# EasyEDA Pro project ProProject_bag cutting clutch break controller_2024-04-06.epro

# Schematic Schematic1
Create Date: 2024-03-30; Page Name: P1; Project Name: bag cutting clutch break controller; Schematic Name: Schematic1; Update Date: 2024-04-04; Company: EasyEDA.com; Drawn: EasyEDA; Page Size: A4; Part Number: JLCPCB-002; Reviewed: EasyEDA; Version: V0.1
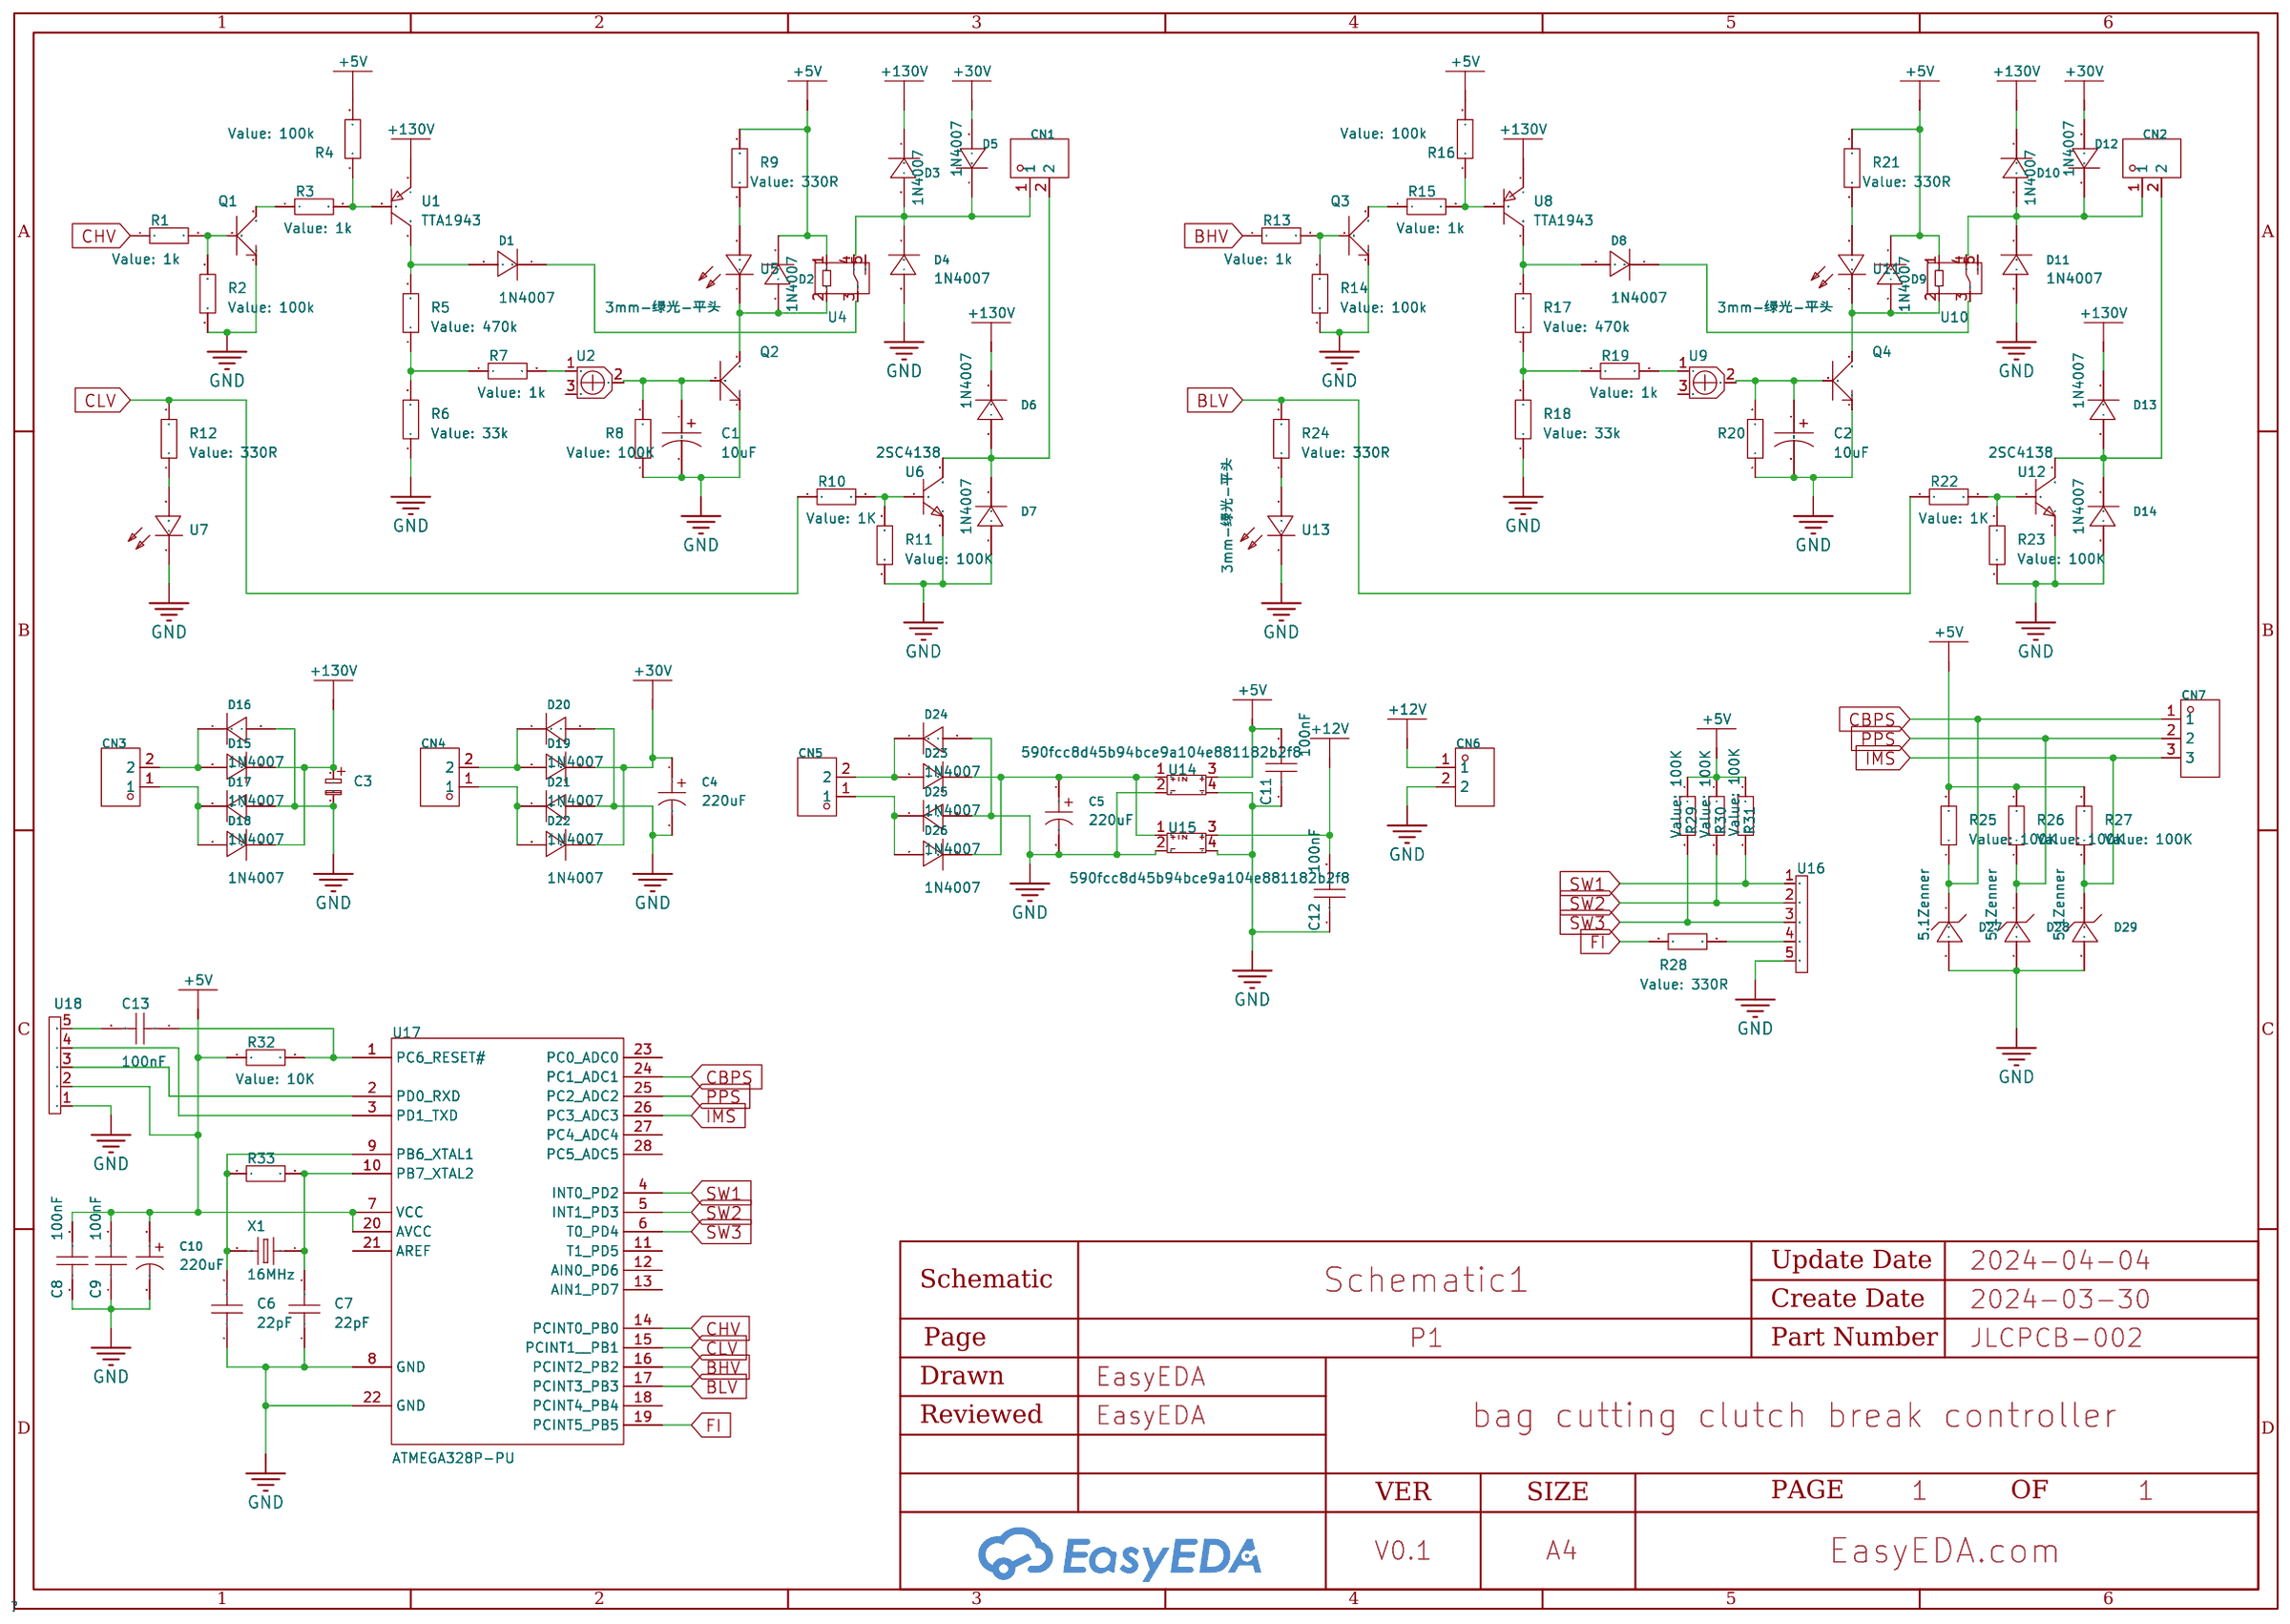
[diagram p0: schematic sheet]

## Parts
C1  10uF  [CAP-TH_BD5.0-P2.00-D0.8-FD]
C2  10uF  [CAP-TH_BD5.0-P2.00-D0.8-FD]
C3  -  [820uf400v]
C4  220uF  [CAP-TH_BD8.0-P3.50-D0.6-FD_1]
C5  220uF  [CAP-TH_BD8.0-P3.50-D0.6-FD_1]
C6  22pF  [CAP-TH_L4.0-W2.6-P2.50-D0.5]
C7  22pF  [CAP-TH_L4.0-W2.6-P2.50-D0.5]
C8  100nF  [CAP-TH_L4.0-W2.6-P2.50-D0.5]
C9  100nF  [CAP-TH_L4.0-W2.6-P2.50-D0.5]
C10  220uF  [CAP-TH_BD8.0-P3.50-D0.6-FD_1]
C11  100nF  [CAP-TH_L4.0-W2.6-P2.50-D0.5]
C12  100nF  [CAP-TH_L4.0-W2.6-P2.50-D0.5]
C13  100nF  [CAP-TH_L4.0-W2.6-P2.50-D0.5]
CN1  MX301-5.0-02P-BU01-Cu-Y-A  [CONN-TH_2P-P5.0-MX301-5.0-02P-BU01-CU-Y-A]
CN2  MX301-5.0-02P-BU01-Cu-Y-A  [CONN-TH_2P-P5.0-MX301-5.0-02P-BU01-CU-Y-A]
CN3  MX301-5.0-02P-BU01-Cu-Y-A  [CONN-TH_2P-P5.0-MX301-5.0-02P-BU01-CU-Y-A]
CN4  MX301-5.0-02P-BU01-Cu-Y-A  [CONN-TH_2P-P5.0-MX301-5.0-02P-BU01-CU-Y-A]
CN5  MX301-5.0-02P-BU01-Cu-Y-A  [CONN-TH_2P-P5.0-MX301-5.0-02P-BU01-CU-Y-A]
CN6  MX301-5.0-02P-BU01-Cu-Y-A  [CONN-TH_2P-P5.0-MX301-5.0-02P-BU01-CU-Y-A]
CN7  MX301-5.0-03P-BU01-Cu-Y-A  [CONN-TH_3P-P5.0-MX301-5.0-03P-BU01-CU-Y-A]
D1  1N4007  [DO-41_BD2.4-L4.7-P8.70-D0.9-RD]
D2  1N4007  [DO-41_BD2.4-L4.7-P8.70-D0.9-RD]
D3  1N4007  [DO-41_BD2.4-L4.7-P8.70-D0.9-RD]
D4  1N4007  [DO-41_BD2.4-L4.7-P8.70-D0.9-RD]
D5  1N4007  [DO-41_BD2.4-L4.7-P8.70-D0.9-RD]
D6  1N4007  [DO-41_BD2.4-L4.7-P8.70-D0.9-RD]
D7  1N4007  [DO-41_BD2.4-L4.7-P8.70-D0.9-RD]
D8  1N4007  [DO-41_BD2.4-L4.7-P8.70-D0.9-RD]
D9  1N4007  [DO-41_BD2.4-L4.7-P8.70-D0.9-RD]
D10  1N4007  [DO-41_BD2.4-L4.7-P8.70-D0.9-RD]
D11  1N4007  [DO-41_BD2.4-L4.7-P8.70-D0.9-RD]
D12  1N4007  [DO-41_BD2.4-L4.7-P8.70-D0.9-RD]
D13  1N4007  [DO-41_BD2.4-L4.7-P8.70-D0.9-RD]
D14  1N4007  [DO-41_BD2.4-L4.7-P8.70-D0.9-RD]
D15  1N4007  [DO-41_BD2.4-L4.7-P8.70-D0.9-RD]
D16  1N4007  [DO-41_BD2.4-L4.7-P8.70-D0.9-RD]
D17  1N4007  [DO-41_BD2.4-L4.7-P8.70-D0.9-RD]
D18  1N4007  [DO-41_BD2.4-L4.7-P8.70-D0.9-RD]
D19  1N4007  [DO-41_BD2.4-L4.7-P8.70-D0.9-RD]
D20  1N4007  [DO-41_BD2.4-L4.7-P8.70-D0.9-RD]
D21  1N4007  [DO-41_BD2.4-L4.7-P8.70-D0.9-RD]
D22  1N4007  [DO-41_BD2.4-L4.7-P8.70-D0.9-RD]
D23  1N4007  [DO-41_BD2.4-L4.7-P8.70-D0.9-RD]
D24  1N4007  [DO-41_BD2.4-L4.7-P8.70-D0.9-RD]
D25  1N4007  [DO-41_BD2.4-L4.7-P8.70-D0.9-RD]
D26  1N4007  [DO-41_BD2.4-L4.7-P8.70-D0.9-RD]
D27  5.1Zenner  [DO-35_BD2.0-L4.2-P8.20-D0.5-RD]
D28  5.1Zenner  [DO-35_BD2.0-L4.2-P8.20-D0.5-RD]
D29  5.1Zenner  [DO-35_BD2.0-L4.2-P8.20-D0.5-RD]
Q1  -  [TH100]
Q2  -  [TH100]
Q3  -  [TH100]
Q4  -  [TH100]
R1  1k  [TH300]
R2  100k  [TH300]
R3  1k  [TH300]
R4  100k  [TH300]
R5  470k  [TH500R]
R6  33k  [TH500R]
R7  1k  [TH300]
R8  100K  [TH300]
R9  330R  [TH300]
R10  1K  [TH300]
R11  100K  [TH300]
R12  330R  [TH300]
R13  1k  [TH300]
R14  100k  [TH300]
R15  1k  [TH300]
R16  100k  [TH300]
R17  470k  [TH500R]
R18  33k  [TH500R]
R19  1k  [TH300]
R20  -  [TH300]
R21  330R  [TH300]
R22  1K  [TH300]
R23  100K  [TH300]
R24  330R  [TH300]
R25  100K  [TH300]
R26  100K  [TH300]
R27  100K  [TH300]
R28  330R  [TH300]
R29  100K  [TH300]
R30  100K  [TH300]
R31  100K  [TH300]
R32  10K  [TH300]
R33  -  [TH300]
U1  TTA1943  [TO-3PL_L20.0-W5.0-P5.45-L]
U2  -  [VR plastic]
U4  -  [relat5pin]
U5  3mm-绿光-平头  [LED-TH_BD4.0-P2.00-D0.5-RD_GREEN]
U6  2SC4138  [TO-3PN_L15.8-W5.0-P5.45-L]
U7  3mm-绿光-平头  [LED-TH_BD4.0-P2.00-D0.5-RD_GREEN]
U8  TTA1943  [TO-3PL_L20.0-W5.0-P5.45-L]
U9  -  [VR plastic]
U10  -  [relat5pin]
U11  3mm-绿光-平头  [LED-TH_BD4.0-P2.00-D0.5-RD_GREEN]
U12  2SC4138  [TO-3PN_L15.8-W5.0-P5.45-L]
U13  3mm-绿光-平头  [LED-TH_BD4.0-P2.00-D0.5-RD_GREEN]
U14  590fcc8d45b94bce9a104e881182b2f8  [buck converter LM2596S]
U15  590fcc8d45b94bce9a104e881182b2f8  [buck converter LM2596S]
U16  -  [5pin header]
U17  ATMEGA328P-PU  [DIP-28_L34.6-W7.3-P2.54-LS10.2-BL]
U18  -  [5pin header]
X1  16MHz  [HC-49US_L11.5-W4.5-P4.88]

## Library data of the parts
C1 C2 = 01EC1809SHC10UF50V: Capacitance: Tolerance:±20% Tolerance:±20% Rated Voltage: Ripple Current:50mA@120Hz Equivalent Series Resistance(ESR):- Lead Spacing: φD: L: Lifetime @ Temp:5000hrs@105℃; LCSC Part Name: 10uF ±20% 50V; Supplier Part: C503219; Manufacturer: KNSCHA(科尼盛); Supplier Footprint: 插件,D5xL11mm; JLCPCB Part Class: Extended Part; Datasheet: https://atta.szlcsc.com/upload/public/pdf/source/20200324/C503219_39D1683F20D4DB1C41D8BE9142629697.pdf; Supplier: LCSC; Tolerance: ±20%; Ripple Current: 50mA@120Hz; Lifetime @ Temp: 5000hrs@105℃
C3 = 820uf 400v
C4 C5 C10 = 35V220uF CD110: Capacitance: Tolerance:±20% Tolerance:±20% Rated Voltage: Lead Spacing: φD: L: Operating Temperature:-40℃~+105℃ Operating Temperature:-40℃~+105℃; LCSC Part Name: 220uF ±20% 35V; Supplier Part: C2960236; Manufacturer: HRK(鸿瑞凯电子); Supplier Footprint: 插件,D8xL12mm; JLCPCB Part Class: Extended Part; Datasheet: https://atta.szlcsc.com/upload/public/pdf/source/20220224/7F5DF6788BF91316DB22641A0841F4D2.pdf; Supplier: LCSC; Tolerance: ±20%; Operating Temperature: -40℃~+105℃
C6-C9 C11-C13 = K220J15C0GF5TL2: Capacitance: Tolerance:±5% Tolerance:±5% Voltage Rated: Temperature Coefficient:; LCSC Part Name: 22pF ±5% 50V; Supplier Part: C2170230; Manufacturer: VISHAY(威世); Supplier Footprint: 插件; JLCPCB Part Class: Extended Part; Datasheet: https://atta.szlcsc.com/upload/public/pdf/source/20210702/6531D680143ED60327F22057485455BA.pdf; Supplier: LCSC; Tolerance: ±5%
CN1-CN6 = MX301-5.0-02P-BU01-Cu-Y-A: Structure:1x2P Pitch:5mm Color:Blue Mounting Style:Straight Current Rating (Max):16A Voltage Rating (Max):300V Number of Pins:2P Number of Rows:1 Wire Gauge - AWG:14~24 Wire Gauge - AWG:14~24 Wire Gauge - mm2:1.5 Wire Gauge - mm2:1.5 Number of PINs Per Ro; LCSC Part Name: 5mm 1x2P 排数:1 每排P数:2 直插; Supplier Part: C5188422; Manufacturer: MAX(迈旭); Supplier Footprint: 插件,P=5mm; JLCPCB Part Class: Extended Part; Datasheet: https://atta.szlcsc.com/upload/public/pdf/source/20230915/1F0A484E8C4B07E7C9BE20D191F8A304.pdf; Supplier: LCSC; Structure: 1x2P; Pitch: 5mm; Color: Blue; Mounting Style: Straight; Current Rating (Max): 16A; Voltage Rating (Max): 300V; Number of Pins: 2P; Number of Rows: 1; Wire Gauge - AWG: 14~24; Wire Gauge - mm2: 1.5; Number of PINs Per Row: 2; Contact Material: Copper Alloy; Contact Plating: Tin; Operating Temperature Range: -40℃~+105℃
CN7 = MX301-5.0-03P-BU01-Cu-Y-A: Structure:1x3P Pitch:5mm Color:Blue Mounting Style:Straight Current Rating (Max):16A Voltage Rating (Max):300V Number of Pins:3P Number of Rows:1 Wire Gauge - AWG:14~24 Wire Gauge - AWG:14~24 Wire Gauge - mm2:1.5 Wire Gauge - mm2:1.5 Number of PINs Per Ro; LCSC Part Name: 5mm 1x3P 排数:1 每排P数:3 直插; Supplier Part: C5188423; Manufacturer: MAX(迈旭); Supplier Footprint: 插件,P=5mm; JLCPCB Part Class: Extended Part; Datasheet: https://atta.szlcsc.com/upload/public/pdf/source/20230915/1F0A484E8C4B07E7C9BE20D191F8A304.pdf; Supplier: LCSC; Structure: 1x3P; Pitch: 5mm; Color: Blue; Mounting Style: Straight; Current Rating (Max): 16A; Voltage Rating (Max): 300V; Number of Pins: 3P; Number of Rows: 1; Wire Gauge - AWG: 14~24; Wire Gauge - mm2: 1.5; Number of PINs Per Row: 3; Contact Material: Copper Alloy; Contact Plating: Tin; Operating Temperature Range: -40℃~+105℃
D1-D26 = 1N4007_C193790: Diode Configuration: Forward Voltage (Vf@If):1.1V@1A Reverse Voltage (Vr): Average Rectified Current (Io): Reverse Leakage Current:5uA@1kV; LCSC Part Name: 电压:1kV 电流:1A; Supplier Part: C193790; Manufacturer: GD(固锝); Supplier Footprint: DO-41; JLCPCB Part Class: Extended Part; Datasheet: https://atta.szlcsc.com/upload/public/pdf/source/20180620/C193790_00AC32136EDFF797F8AFCD049E07A564.pdf; Supplier: LCSC; Forward Voltage (Vf@If): 1.1V@1A; Reverse Leakage Current: 5uA@1kV
D27-D29 = ZPD5.1: Diode Configuration:Single Zener Voltage (Nom):- Reverse Leakage Current (Ir):100nA@800mV Zener Voltage (Range):4.8V~5.4V Zener Voltage (Range):4.8V~5.4V Power Dissipation:500mW Zener Impedance (Zzt):60Ω Tolerance:±5% Tolerance:±5%; Supplier Part: C212807; Manufacturer: DIOTEC(德欧泰克); Supplier Footprint: DO-35; JLCPCB Part Class: Extended Part; Datasheet: https://atta.szlcsc.com/upload/public/pdf/source/20180628/C212807_D3FB3E606FA6D3C4C650B21A494D66C7.pdf; Supplier: LCSC; Diode Configuration: Single; Reverse Leakage Current (Ir): 100nA@800mV; Zener Voltage (Range): 4.8V~5.4V; Power Dissipation: 500mW; Zener Impedance (Zzt): 60Ω; Tolerance: ±5%
Q1-Q4 = D400
R1-R4 R7-R16 R19-R33 = ressister
R5 R6 R17 R18 = 1/2w
U1 U8 = TTA1943: Transistor Type: Collector Current (Ic): Collector-Emitter Breakdown Voltage (Vceo): Power Dissipation (Pd): DC Current Gain (hFE@Ic,Vce):80@1A,5V DC Current Gain (hFE@Ic,Vce):80@1A,5V Transition Frequency (fT):30MHz Collector-Emitter Saturation Voltage (; LCSC Part Name: PNP 电流:15A 耐压:230V; Supplier Part: C5366139; Manufacturer: minos(迈诺斯); Supplier Footprint: TO-3PL; Datasheet: https://atta.szlcsc.com/upload/public/pdf/source/20230301/085D052E5ACCB1EF97B1D2E83DA3C388.pdf; Supplier: LCSC; DC Current Gain (hFE@Ic,Vce): 80@1A,5V; Transition Frequency (fT): 30MHz; Collector-Emitter Saturation Voltage (VCE(sat)@Ic,Ib): 3V@8A,800mA
U2 U9 = VR plastic
U4 U10 = relay5pin
U5 U7 U11 U13 = 3mm-绿光-平头: Supplier Part: C9900015331; Supplier Footprint: LED-T-3mm; JLCPCB Part Class: Extended Part; Supplier: LCSC
U6 U12 = 2SC4138: Supplier Part: C2907803; Manufacturer: SPTECH(深圳质超); Supplier Footprint: TO-3PN; JLCPCB Part Class: Extended Part; Supplier: LCSC
U14 U15 = buck converter LM2596S
U16 U18 = 5pin header
U17 = ATMEGA328P-PU: CPU Core:AVR Program Storage Size:32KB RAM Size:2KB GPIO Ports Number:23 Operating Voltage Range:1.8V~5.5V Operating Voltage Range:1.8V~5.5V CPU Maximum Speed:20MHz Program Memory Type:FLASH EEPROM:1KB Operating Temperature Range:-40℃~+85℃ Operating Tempe; LCSC Part Name: 基于AVR增强型RISC架构的低功耗CMOS 8位微控制器 MSL=1; Supplier Part: C33901; Manufacturer: MICROCHIP(美国微芯); Supplier Footprint: DIP-28-300mil; JLCPCB Part Class: Extended Part; Datasheet: https://atta.szlcsc.com/upload/public/pdf/source/20150124/1457707257819.pdf; Supplier: LCSC; CPU Core: AVR; Program Storage Size: 32KB; RAM Size: 2KB; GPIO Ports Number: 23; Operating Voltage Range: 1.8V~5.5V; CPU Maximum Speed: 20MHz; Program Memory Type: FLASH; EEPROM: 1KB; Operating Temperature Range: -40℃~+85℃; ADC (Bit): 10bit; Peripheral/Function: WDT；PWM; Watchdog: 有; Low-Voltage Detect: 有; Internal Oscillator: 有
X1 = XIHCELNANF-16MHZ: Crystal Type:直插晶振 Frequency:16MHz Normal temperature Frequency Tolerance:±30ppm Normal temperature Frequency Tolerance:±30ppm External load capacitor:20pF Frequency Stability(Full temperature range):±30ppm Frequency Stability(Full temperature range):±30pp; LCSC Part Name: 16MHz ±30ppm 20pF; Supplier Part: C295075; Manufacturer: TAITIEN(泰艺电子); Supplier Footprint: HC-49S; JLCPCB Part Class: Extended Part; Datasheet: https://atta.szlcsc.com/upload/public/pdf/source/20190107/C358649_B3943D1FEB8737E4FCE005A191A94016.pdf; Supplier: LCSC; Crystal Type: 直插晶振; Normal temperature Frequency Tolerance: ±30ppm; External load capacitor: 20pF; Frequency Stability(Full temperature range): ±30ppm

## Nets
+5V: C8.2 C9.2 C10.1 C11.2 D2.1(C) D9.1(C) R4.2 R9.2 R16.2 R21.2 R25.2 R26.2 R27.2 R29.1 R30.1 R31.1 R32.1 U4.1 U10.1 U14.3 U17.7(VCC) U17.20(AVCC) U18.2
+12V: C12.2 CN6.1 U15.3
+30V: C4.1 D5.2(A) D12.2(A) D19.1(C) D22.1(C)
+130V: C3.1 D3.1(C) D6.1(C) D10.1(C) D13.1(C) D15.1(C) D18.1(C) U1.3(E) U8.3(E)
GND: C1.2 C2.2 C3.2 C4.2 C5.2 C6.1 C7.1 C8.1 C9.1 C10.2 C11.1 C12.1 CN6.2 D4.2(A) D7.2(A) D11.2(A) D14.2(A) D16.2(A) D17.2(A) D20.2(A) D21.2(A) D24.2(A) D25.2(A) D27.2(A) D28.2(A) D29.2(A) Q1.1(E) Q2.1(E) Q3.1(E) Q4.1(E) R2.1 R6.1 R8.1 R11.1 R14.1 R18.1 R20.1 R23.1 U6.3(E) U7.1 U12.3(E) U13.1 U14.2 U14.4 U15.2 U15.4 U16.5 U17.8(GND) U17.22(GND) U18.1
BHV: R13.1 U17.16(PCINT2 PB2)
BLV: R22.1 R24.2 U17.17(PCINT3 PB3)
CBPS: CN7.1 D27.1(C) R25.1 U17.24(PC1 ADC1)
CHV: R1.1 U17.14(PCINT0 PB0)
CLV: R10.1 R12.2 U17.15(PCINT1  PB1)
FI: R28.1 U17.19(PCINT5 PB5)
IMS: CN7.3 D29.1(C) R27.1 U17.26(PC3 ADC3)
PPS: CN7.2 D28.1(C) R26.1 U17.25(PC2 ADC2)
SW1: R31.2 U16.1 U17.4(INT0 PD2)
SW2: R30.2 U16.2 U17.5(INT1 PD3)
SW3: R29.2 U16.3 U17.6(T0 PD4)
$1N881: Q1.3(B) R1.2 R2.2
$1N885: Q1.2(C) R3.1
$1N1469: R3.2 R4.1 U1.1(B)
$1N1482: R5.1 R6.2 R7.1
$1N1581: D1.2(A) R5.2 U1.2(C)
$1N2265: R7.2 U2.1
$1N2438: D2.2(A) Q2.2(C) U4.2 U5.1
$1N2445: R9.1 U5.2
$1N2514: C1.1 Q2.3(B) R8.2 U2.2
$1N3198: D1.1(C) U4.3
$1N3543: CN1.1 D3.2(A) D4.1(C) D5.1(C) U4.4
$1N3736: R10.2 R11.2 U6.1(B)
$1N3816: CN1.2 D6.2(A) D7.1(C) U6.2(C)
$1N3949: R12.1 U7.2
$1N7232: Q3.3(B) R13.2 R14.2
$1N7233: Q3.2(C) R15.1
$1N7238: R15.2 R16.1 U8.1(B)
$1N7240: D8.2(A) R17.2 U8.2(C)
$1N7241: R17.1 R18.2 R19.1
$1N7242: R19.2 U9.1
$1N7256: D9.2(A) Q4.2(C) U10.2 U11.1
$1N7257: R21.1 U11.2
$1N7258: C2.1 Q4.3(B) R20.2 U9.2
$1N7259: D8.1(C) U10.3
$1N7271: CN2.1 D10.2(A) D11.1(C) D12.1(C) U10.4
$1N7288: R22.2 R23.2 U12.1(B)
$1N7292: CN2.2 D13.2(A) D14.1(C) U12.2(C)
$1N7302: R24.1 U13.2
$1N8581: CN3.2 D15.2(A) D16.1(C)
$1N8589: CN3.1 D17.1(C) D18.2(A)
$1N8975: CN4.2 D19.2(A) D20.1(C)
$1N8978: CN4.1 D21.1(C) D22.2(A)
$1N9405: CN5.2 D23.2(A) D24.1(C)
$1N9408: CN5.1 D25.1(C) D26.2(A)
$1N9556: C5.1 D23.1(C) D26.1(C) U14.1 U15.1
$1N10766: R28.2 U16.4
$1N11606: C7.2 R33.2 U17.10(PB7 XTAL2) X1.1
$1N11615: C6.2 R33.1 U17.9(PB6 XTAL1) X1.2
$1N11970: C13.2 U18.5
$1N11973: C13.1 R32.2 U17.1(PC6 RESET#)
$1N11982: U17.3(PD1 TXD) U18.4
$1N11987: U17.2(PD0 RXD) U18.3

Not connected (* = marked no-connect by the designer): U2 3; U4 5; U9 3; U10 5; U17 11(T1 PD5) 12(AIN0 PD6) 13(AIN1 PD7) 18(PCINT4 PB4) 21(AREF) 23(PC0 ADC0) 27(PC4 ADC4) 28(PC5 ADC5)

# Board PCB1
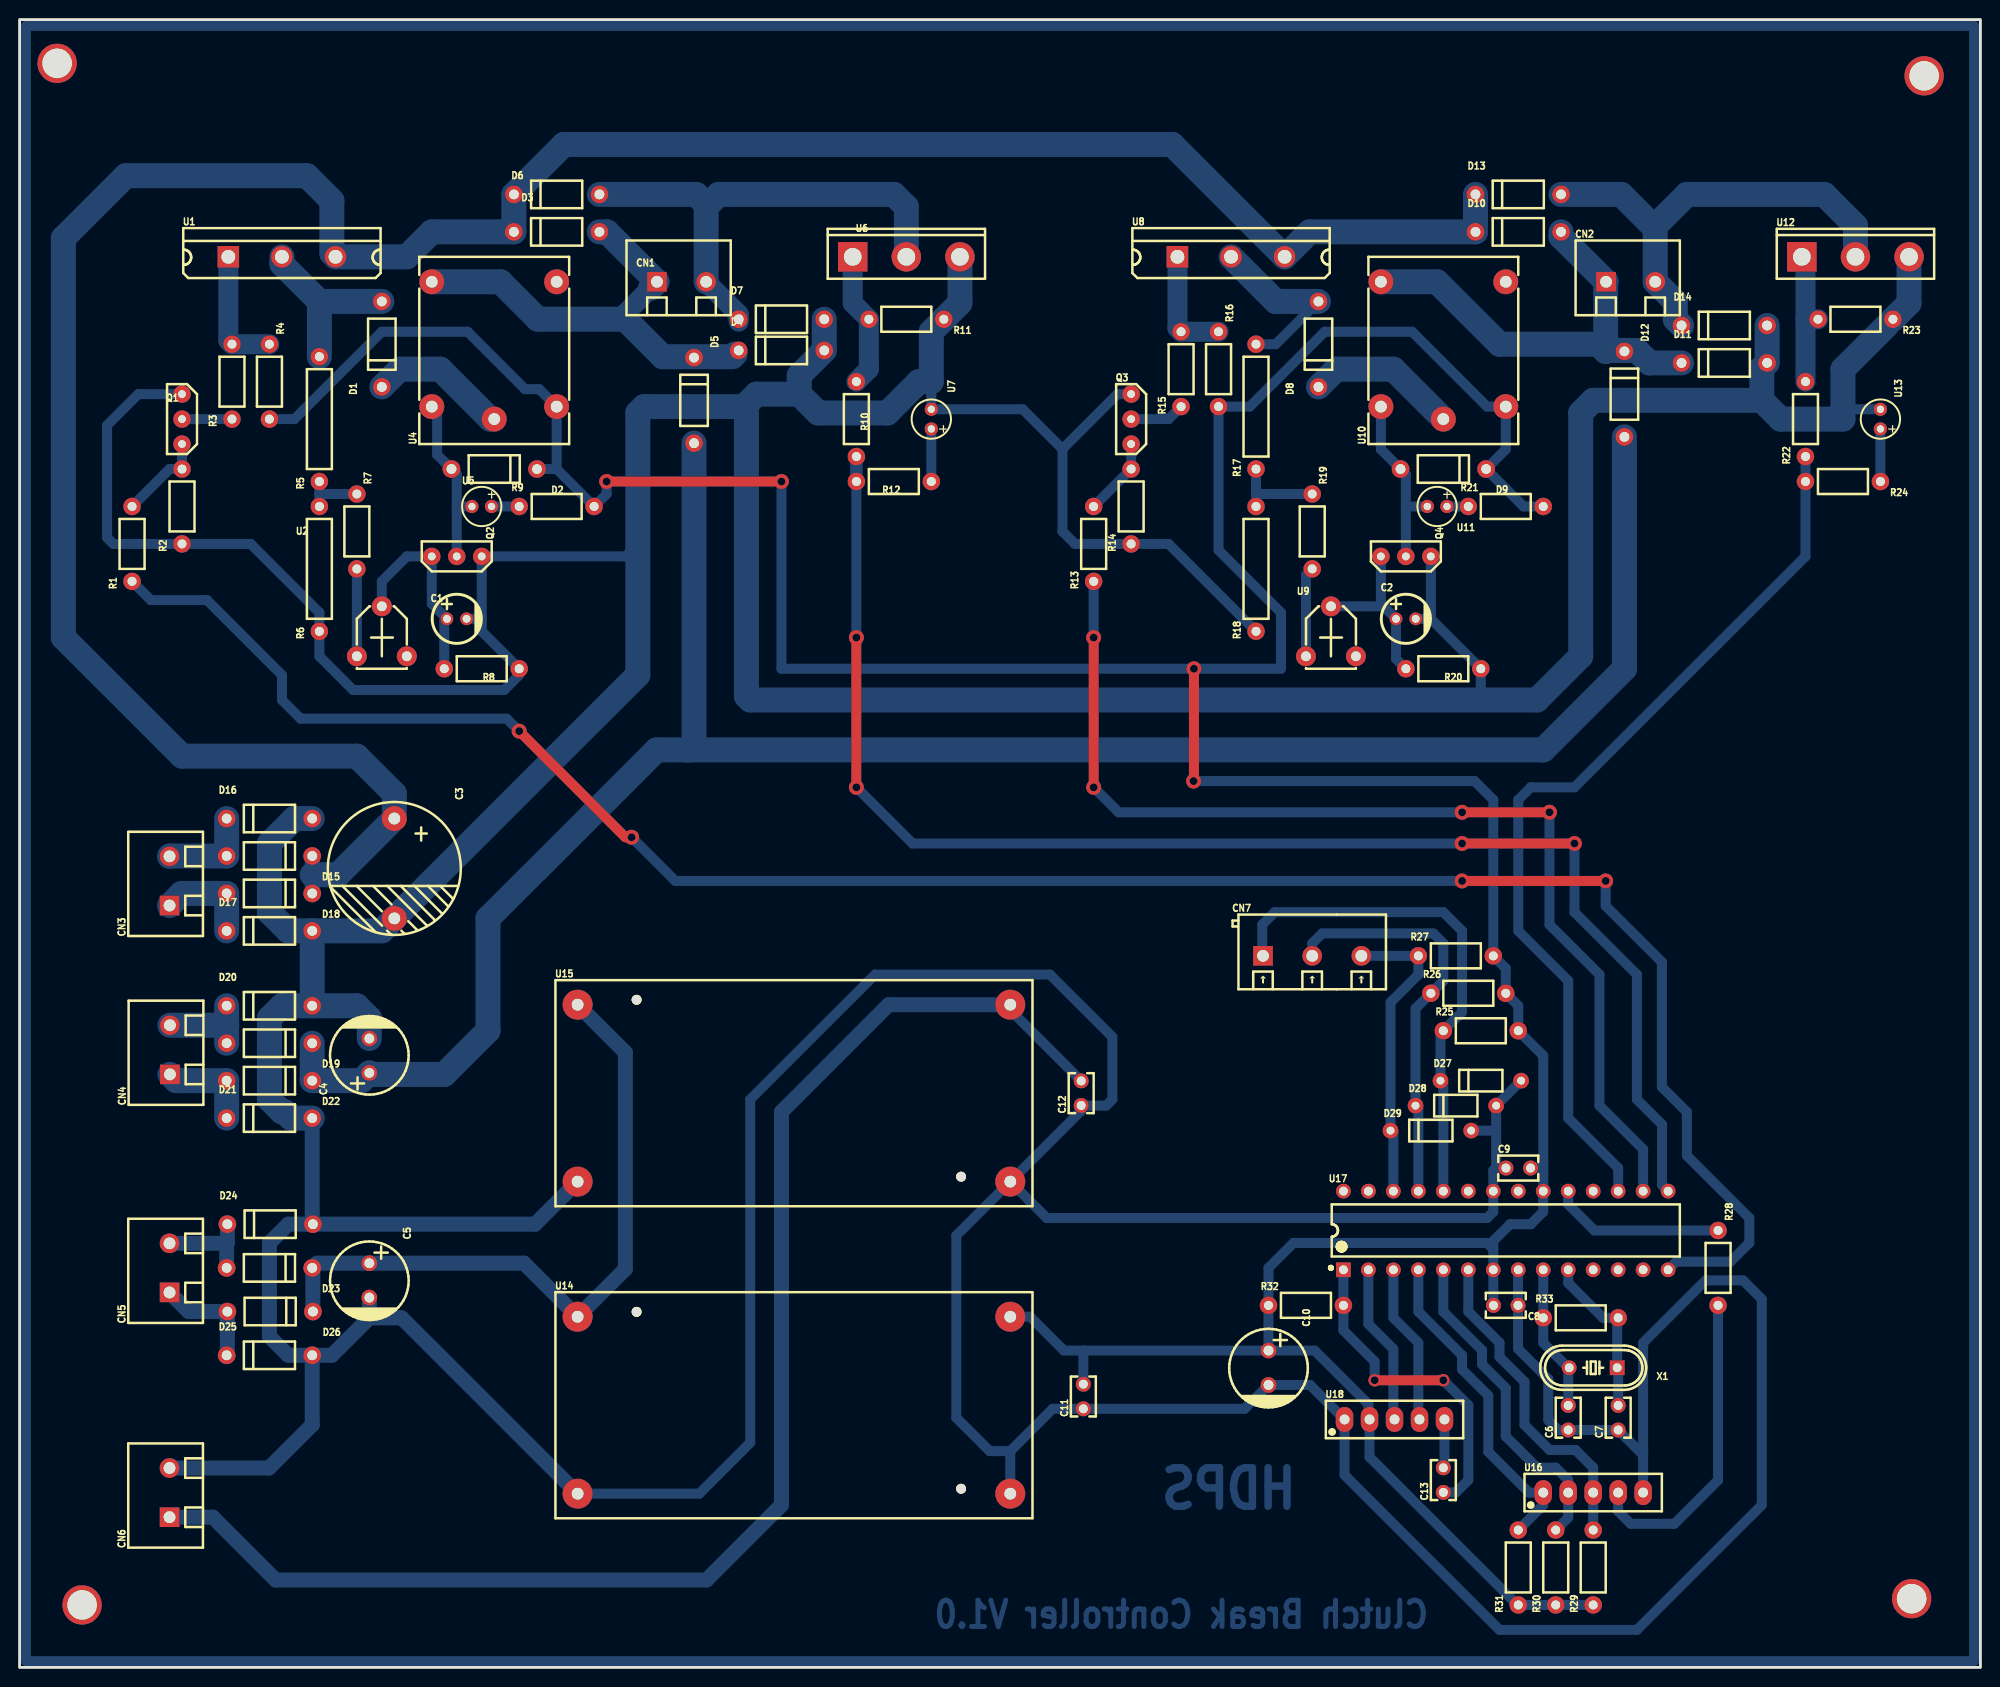
[diagram p1: board, top side]
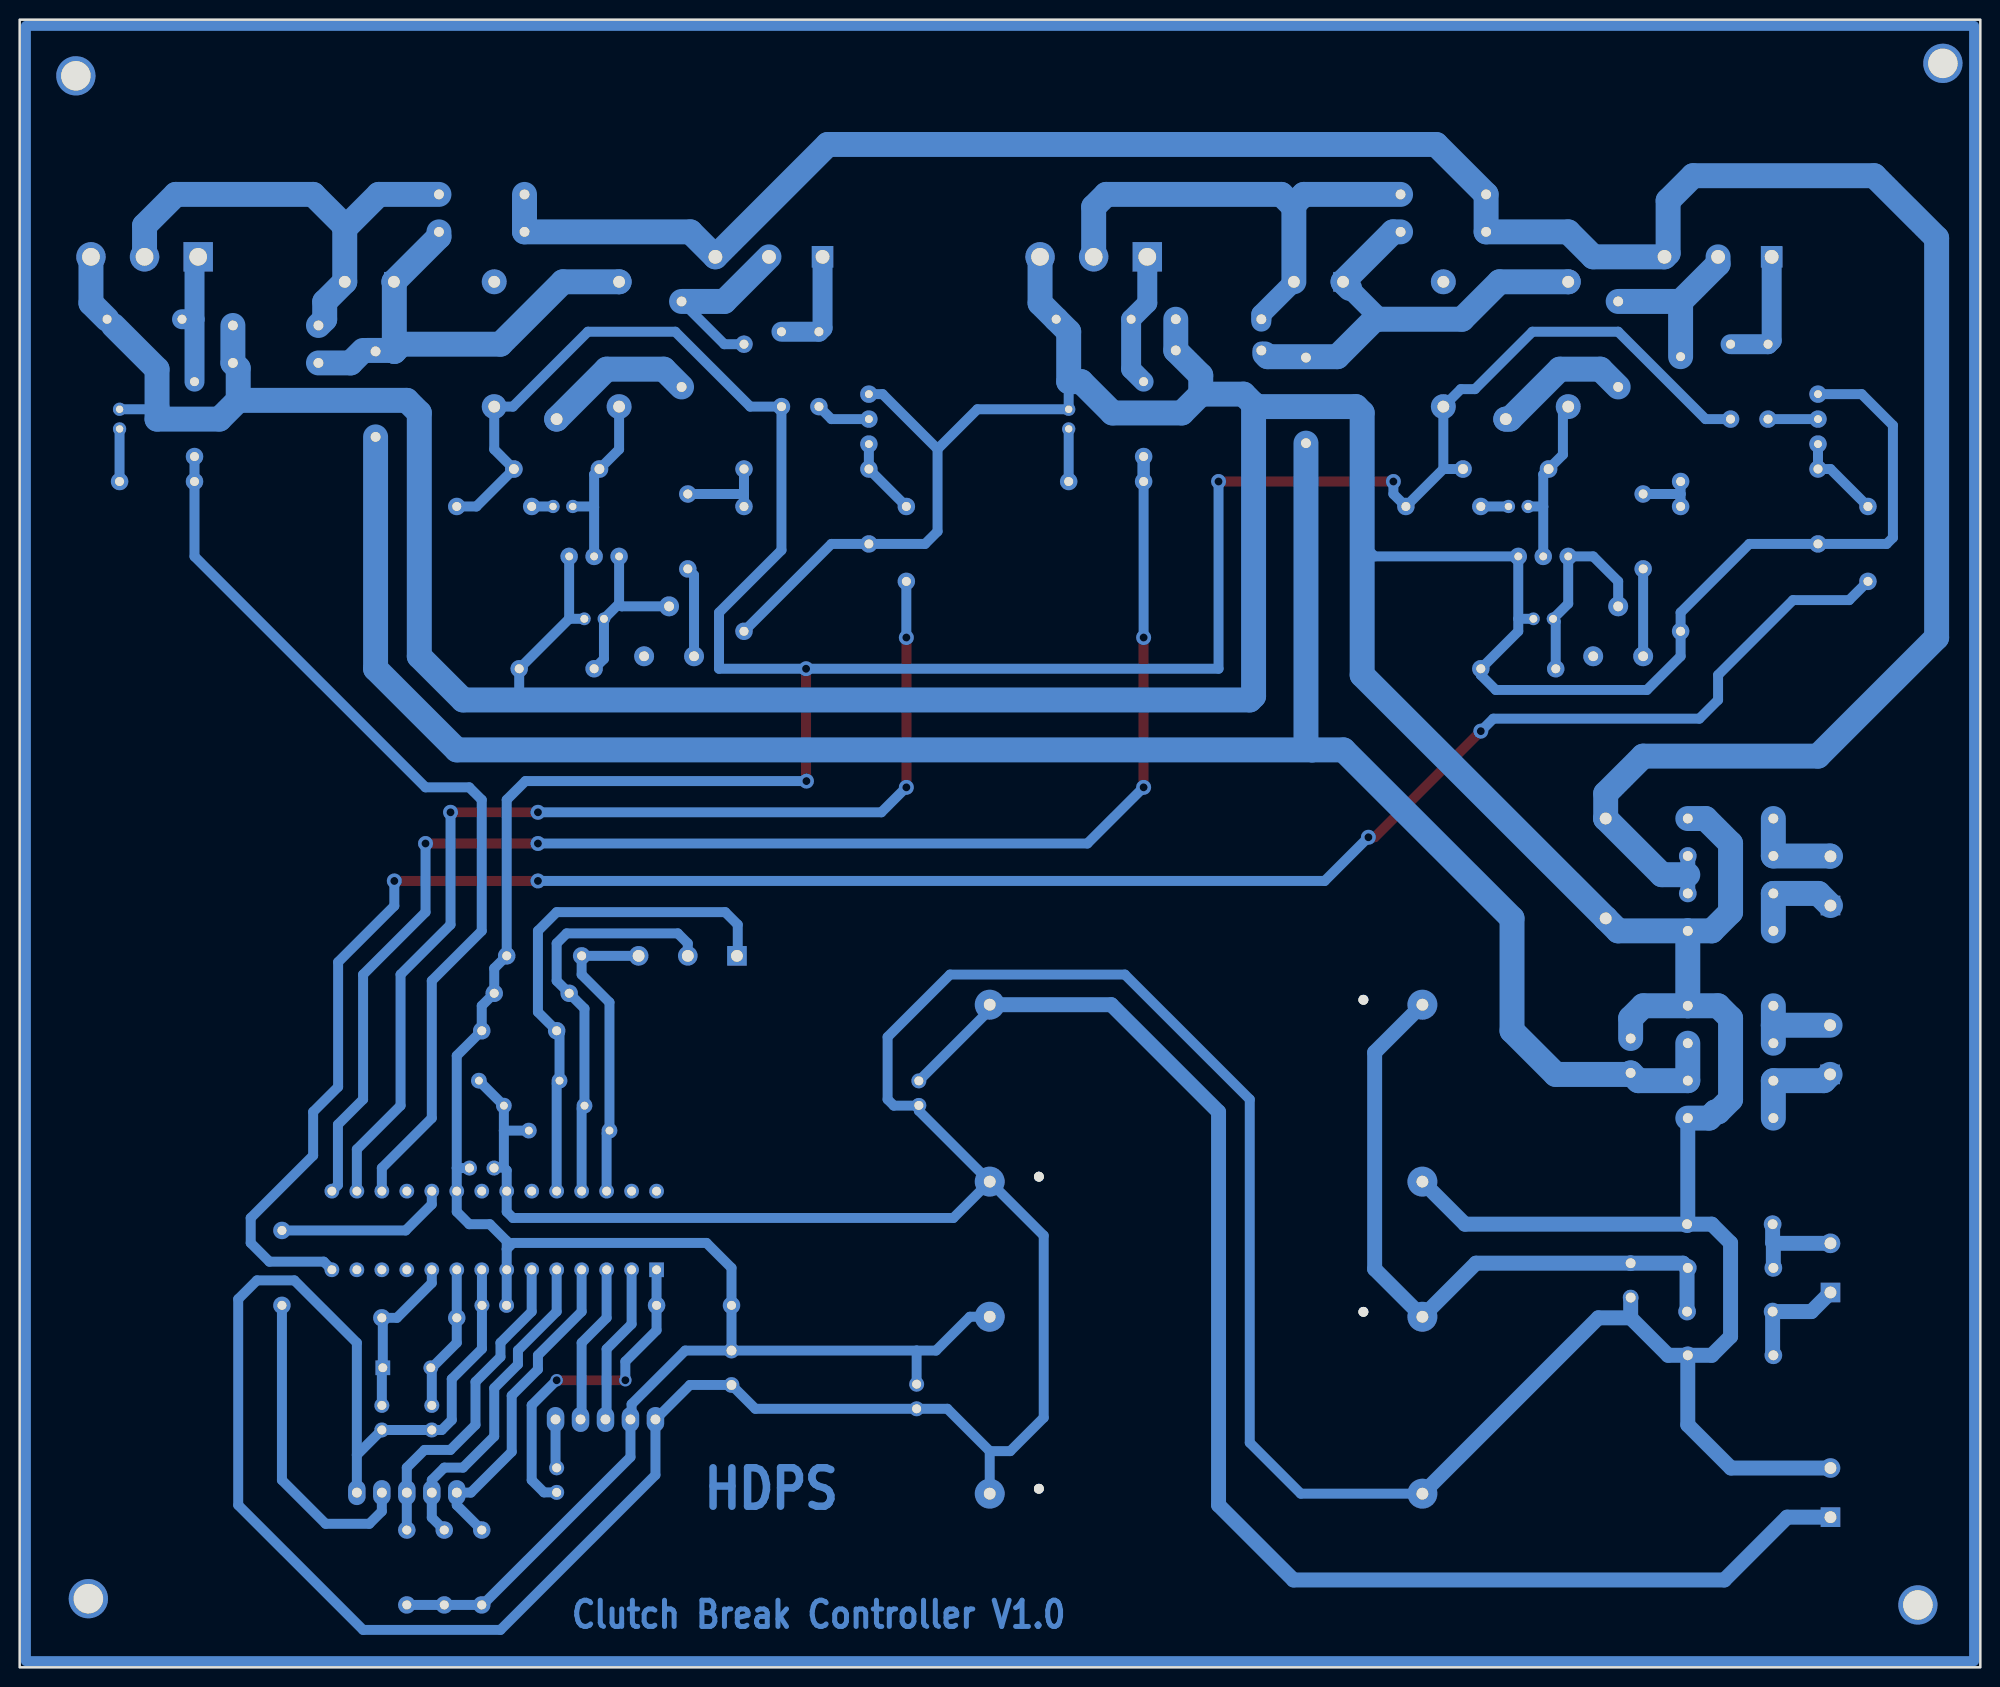
[diagram p2: board, bottom side, seen from below]

Outline 199.39 x 167.64 mm; copper layers: Top Layer, Bottom Layer. Coordinates in mm from the lower left corner of the outline.
Outline path: rectangle 0,167.64 199.39,0
Stack: Top Layer 0.035mm / Dielectric1 1.51mm FR4 er 4.5 / Bottom Layer 0.035mm

## Design rules (mm)
template: Custom Config
spacing copperThickness1oz (default): track to track 0.762, other pairs 0.152 to 1.016
spacing copperThickness2oz: track to track 0.203, other pairs 0.152 to 0.3
track width copperThickness1oz (default): min 0.127, default 0.254, max 2.54
track width copperThickness2oz: min 0.203, default 0.254, max 2.54
differential pair differentialPair (default): width min 0.127, default 0.254, max 2.54; gap min 0.152, default 0.152
via viaSize (default): diameter min 0.5, default 0.61, max 10; hole min 0.3, default 0.305, max 6.299

## Placement (name value [footprint] x y rotation side)
C1  10uF  [CAP-TH_BD5.0-P2.00-D0.8-FD]  44.45 106.68 0 top
C2  10uF  [CAP-TH_BD5.0-P2.00-D0.8-FD]  140.97 106.68 0 top
C3  -  [820uf400v]  38.1 81.28 270 top
C4  220uF  [CAP-TH_BD8.0-P3.50-D0.6-FD_1]  35.56 62.23 90 top
C5  220uF  [CAP-TH_BD8.0-P3.50-D0.6-FD_1]  35.56 39.37 270 top
C6  22pF  [CAP-TH_L4.0-W2.6-P2.50-D0.5]  157.48 25.4 90 top
C7  22pF  [CAP-TH_L4.0-W2.6-P2.50-D0.5]  162.56 25.4 90 top
C8  100nF  [CAP-TH_L4.0-W2.6-P2.50-D0.5]  151.13 36.83 180 top
C9  100nF  [CAP-TH_L4.0-W2.6-P2.50-D0.5]  152.4 50.8 0 top
C10  220uF  [CAP-TH_BD8.0-P3.50-D0.6-FD_1]  127 30.48 270 top
C11  100nF  [CAP-TH_L4.0-W2.6-P2.50-D0.5]  108.17 27.56 90 top
C12  100nF  [CAP-TH_L4.0-W2.6-P2.50-D0.5]  107.95 58.42 90 top
C13  100nF  [CAP-TH_L4.0-W2.6-P2.50-D0.5]  144.78 19.05 90 top
CN1  MX301-5.0-02P-BU01-Cu-Y-A  [CONN-TH_2P-P5.0-MX301-5.0-02P-BU01-CU-Y-A]  67.31 140.97 0 top
CN2  MX301-5.0-02P-BU01-Cu-Y-A  [CONN-TH_2P-P5.0-MX301-5.0-02P-BU01-CU-Y-A]  163.83 140.97 0 top
CN3  MX301-5.0-02P-BU01-Cu-Y-A  [CONN-TH_2P-P5.0-MX301-5.0-02P-BU01-CU-Y-A]  15.24 80.01 90 top
CN4  MX301-5.0-02P-BU01-Cu-Y-A  [CONN-TH_2P-P5.0-MX301-5.0-02P-BU01-CU-Y-A]  15.28 62.83 90 top
CN5  MX301-5.0-02P-BU01-Cu-Y-A  [CONN-TH_2P-P5.0-MX301-5.0-02P-BU01-CU-Y-A]  15.24 40.64 90 top
CN6  MX301-5.0-02P-BU01-Cu-Y-A  [CONN-TH_2P-P5.0-MX301-5.0-02P-BU01-CU-Y-A]  15.24 17.78 90 top
CN7  MX301-5.0-03P-BU01-Cu-Y-A  [CONN-TH_3P-P5.0-MX301-5.0-03P-BU01-CU-Y-A]  131.44 72.39 0 top
D1  1N4007  [DO-41_BD2.4-L4.7-P8.70-D0.9-RD]  36.83 134.62 90 top
D2  1N4007  [DO-41_BD2.4-L4.7-P8.70-D0.9-RD]  48.26 121.92 180 top
D3  1N4007  [DO-41_BD2.4-L4.7-P8.70-D0.9-RD]  54.61 146.05 0 top
D4  1N4007  [DO-41_BD2.4-L4.7-P8.70-D0.9-RD]  77.47 133.99 0 top
D5  1N4007  [DO-41_BD2.4-L4.7-P8.70-D0.9-RD]  68.58 128.91 270 top
D6  1N4007  [DO-41_BD2.4-L4.7-P8.70-D0.9-RD]  54.61 149.86 0 top
D7  1N4007  [DO-41_BD2.4-L4.7-P8.70-D0.9-RD]  77.47 137.16 0 top
D8  1N4007  [DO-41_BD2.4-L4.7-P8.70-D0.9-RD]  132.08 134.62 90 top
D9  1N4007  [DO-41_BD2.4-L4.7-P8.70-D0.9-RD]  144.78 121.92 180 top
D10  1N4007  [DO-41_BD2.4-L4.7-P8.70-D0.9-RD]  152.4 146.05 0 top
D11  1N4007  [DO-41_BD2.4-L4.7-P8.70-D0.9-RD]  173.35 132.72 0 top
D12  1N4007  [DO-41_BD2.4-L4.7-P8.70-D0.9-RD]  163.19 129.54 270 top
D13  1N4007  [DO-41_BD2.4-L4.7-P8.70-D0.9-RD]  152.4 149.86 0 top
D14  1N4007  [DO-41_BD2.4-L4.7-P8.70-D0.9-RD]  173.35 136.53 0 top
D15  1N4007  [DO-41_BD2.4-L4.7-P8.70-D0.9-RD]  25.4 82.55 180 top
D16  1N4007  [DO-41_BD2.4-L4.7-P8.70-D0.9-RD]  25.4 86.36 0 top
D17  1N4007  [DO-41_BD2.4-L4.7-P8.70-D0.9-RD]  25.4 74.93 0 top
D18  1N4007  [DO-41_BD2.4-L4.7-P8.70-D0.9-RD]  25.4 78.74 180 top
D19  1N4007  [DO-41_BD2.4-L4.7-P8.70-D0.9-RD]  25.4 63.5 180 top
D20  1N4007  [DO-41_BD2.4-L4.7-P8.70-D0.9-RD]  25.4 67.31 0 top
D21  1N4007  [DO-41_BD2.4-L4.7-P8.70-D0.9-RD]  25.4 55.88 0 top
D22  1N4007  [DO-41_BD2.4-L4.7-P8.70-D0.9-RD]  25.4 59.69 180 top
D23  1N4007  [DO-41_BD2.4-L4.7-P8.70-D0.9-RD]  25.4 40.64 180 top
D24  1N4007  [DO-41_BD2.4-L4.7-P8.70-D0.9-RD]  25.47 45.09 0 top
D25  1N4007  [DO-41_BD2.4-L4.7-P8.70-D0.9-RD]  25.4 31.75 0 top
D26  1N4007  [DO-41_BD2.4-L4.7-P8.70-D0.9-RD]  25.47 36.2 180 top
D27  5.1Zenner  [DO-35_BD2.0-L4.2-P8.20-D0.5-RD]  148.59 59.69 0 top
D28  5.1Zenner  [DO-35_BD2.0-L4.2-P8.20-D0.5-RD]  146.05 57.15 0 top
D29  5.1Zenner  [DO-35_BD2.0-L4.2-P8.20-D0.5-RD]  143.51 54.61 0 top
NOREF  -  [Pad_e58159]  6.35 6.35 0 top
NOREF#2  -  [Pad_e58158]  192.41 6.99 0 top
NOREF#3  -  [Pad_e58156]  3.81 163.19 0 top
NOREF#4  -  [Pad_e58157]  193.68 161.93 0 top
Q1  -  [TH100]  16.51 127 0 top
Q2  -  [TH100]  44.45 113.03 270 top
Q3  -  [TH100]  113.03 127 0 top
Q4  -  [TH100]  140.97 113.03 270 top
R1  1k  [TH300]  11.43 114.3 90 top
R2  100k  [TH300]  16.51 118.11 90 top
R3  1k  [TH300]  21.59 130.81 90 top
R4  100k  [TH300]  25.4 130.81 270 top
R5  470k  [TH500R]  30.48 127 90 top
R6  33k  [TH500R]  30.48 111.76 90 top
R7  1k  [TH300]  34.29 115.57 270 top
R8  100K  [TH300]  46.99 101.6 180 top
R9  330R  [TH300]  54.61 118.11 0 top
R10  1K  [TH300]  85.09 127 90 top
R11  100K  [TH300]  90.17 137.16 180 top
R12  330R  [TH300]  88.9 120.65 180 top
R13  1k  [TH300]  109.22 114.3 90 top
R14  100k  [TH300]  113.03 118.11 90 top
R15  1k  [TH300]  118.11 132.08 90 top
R16  100k  [TH300]  121.92 132.08 270 top
R17  470k  [TH500R]  125.73 128.27 90 top
R18  33k  [TH500R]  125.73 111.76 90 top
R19  1k  [TH300]  131.44 115.57 270 top
R20  -  [TH300]  144.78 101.6 180 top
R21  330R  [TH300]  151.13 118.11 0 top
R22  1K  [TH300]  181.61 127 90 top
R23  100K  [TH300]  186.69 137.16 180 top
R24  330R  [TH300]  185.42 120.65 180 top
R25  100K  [TH300]  148.59 64.77 0 top
R26  100K  [TH300]  147.32 68.58 0 top
R27  100K  [TH300]  146.05 72.39 0 top
R28  330R  [TH300]  172.72 40.64 270 top
R29  100K  [TH300]  160.02 10.16 90 top
R30  100K  [TH300]  156.21 10.16 90 top
R31  100K  [TH300]  152.4 10.16 90 top
R32  10K  [TH300]  130.81 36.83 0 top
R33  -  [TH300]  158.75 35.56 0 top
U1  TTA1943  [TO-3PL_L20.0-W5.0-P5.45-L]  26.67 143.51 0 top
U2  -  [VR plastic]  36.83 107.95 0 top
U4  -  [relat5pin]  48.26 127 90 top
U5  3mm-绿光-平头  [LED-TH_BD4.0-P2.00-D0.5-RD_GREEN]  46.99 118.11 0 top
U6  2SC4138  [TO-3PN_L15.8-W5.0-P5.45-L]  90.17 143.51 0 top
U7  3mm-绿光-平头  [LED-TH_BD4.0-P2.00-D0.5-RD_GREEN]  92.71 127 270 top
U8  TTA1943  [TO-3PL_L20.0-W5.0-P5.45-L]  123.19 143.51 0 top
U9  -  [VR plastic]  133.35 107.95 0 top
U10  -  [relat5pin]  144.78 127 90 top
U11  3mm-绿光-平头  [LED-TH_BD4.0-P2.00-D0.5-RD_GREEN]  144.15 118.11 0 top
U12  2SC4138  [TO-3PN_L15.8-W5.0-P5.45-L]  186.69 143.51 0 top
U13  3mm-绿光-平头  [LED-TH_BD4.0-P2.00-D0.5-RD_GREEN]  189.23 127 270 top
U14  590fcc8d45b94bce9a104e881182b2f8  [buck converter LM2596S]  78.74 26.67 0 top
U15  590fcc8d45b94bce9a104e881182b2f8  [buck converter LM2596S]  78.74 58.42 0 top
U16  -  [5pin header]  160.02 17.78 0 top
U17  ATMEGA328P-PU  [DIP-28_L34.6-W7.3-P2.54-LS10.2-BL]  151.13 44.45 0 top
U18  -  [5pin header]  139.81 25.22 0 top
X1  16MHz  [HC-49US_L11.5-W4.5-P4.88]  160.02 30.48 180 top

## Footprints (pads in the part's own frame, mm; a bottom-side part is the same pattern mirrored in y, then rotated)
5pin header
  oval 1.778x2.54 hole 1: 1(-5.08,0) 2(-2.54,0) 3(0,0) 4(2.54,0) 5(5.08,0)
820uf400v
  round 2.54 hole 1.2: 1(-5.08,0) 2(5.08,0)
buck converter LM2596S
  round 3.048 hole 1.2: 1(-22,9) 2(-22,-9) 3(22,9) 4(22,-9)
  round 1 hole 3: 6(-16,9.5) 7(17,-8.5)
CAP-TH_BD5.0-P2.00-D0.8-FD
  round 1.3 hole 0.8: 1(-1,0) 2(1,0)
CAP-TH_BD8.0-P3.50-D0.6-FD_1
  round 1.6 hole 1: 1(-1.75,0) 2(1.75,0)
CAP-TH_L4.0-W2.6-P2.50-D0.5
  round 1.524 hole 0.914: 1(-1.25,0) 2(1.25,0)
CONN-TH_2P-P5.0-MX301-5.0-02P-BU01-CU-Y-A
  rect 2x2 hole 1.2: 1(-2.5,0)
  round 2 hole 1.2: 2(2.5,0)
CONN-TH_3P-P5.0-MX301-5.0-03P-BU01-CU-Y-A
  rect 2x2 hole 1.2: 1(-5,0)
  round 2 hole 1.2: 2(0,0) 3(5,0)
DIP-28_L34.6-W7.3-P2.54-LS10.2-BL
  rect 1.5x1.5 hole 0.9: 1(-16.51,-4)
  round 1.5 hole 0.9: 2(-13.97,-4) 3(-11.43,-4) 4(-8.89,-4) 5(-6.35,-4) 6(-3.81,-4) 7(-1.27,-4) 8(1.27,-4) 9(3.81,-4) 10(6.35,-4) 11(8.89,-4) 12(11.43,-4) 13(13.97,-4) 14(16.51,-4) 15(16.51,4) 16(13.97,4) 17(11.43,4) 18(8.89,4) 19(6.35,4) 20(3.81,4) 21(1.27,4) 22(-1.27,4) 23(-3.81,4) 24(-6.35,4) 25(-8.89,4) 26(-11.43,4) 27(-13.97,4) 28(-16.51,4)
DO-35_BD2.0-L4.2-P8.20-D0.5-RD
  round 1.6 hole 0.8: 1(-4.1,0) 2(4.1,0)
DO-41_BD2.4-L4.7-P8.70-D0.9-RD
  round 1.8 hole 1: 1(-4.35,0) 2(4.35,0)
HC-49US_L11.5-W4.5-P4.88
  rect 1.5x1.5 hole 0.9: 1(-2.44,0)
  round 1.5 hole 0.9: 2(2.44,0)
LED-TH_BD4.0-P2.00-D0.5-RD_GREEN
  round 1.35 hole 0.75: 1(-1,0) 2(1,0)
Pad_e58156
  round 4 hole 3: 29(0,0)
Pad_e58157
  round 4 hole 3: 30(0,0)
Pad_e58158
  round 4 hole 3: 31(0,0)
Pad_e58159
  round 4 hole 3: 32(0,0)
relat5pin
  round 2.54 hole 1.2: 1(1.27,-6.35) 2(1.27,6.35) 3(0,0) 4(13.97,6.35) 5(13.97,-6.35)
TH100
  round 1.778 hole 0.8: 1(0,2.54) 2(0,0) 3(0,-2.54)
TH300
  round 1.778 hole 0.914x0.8: 1(-3.81,0) 2(3.81,0)
TH500R
  round 1.778 hole 0.914x0.8: 1(-6.35,0) 2(6.35,0)
TO-3PL_L20.0-W5.0-P5.45-L
  rect 2.2x2.2 hole 1.4: 1(-5.45,0)
  round 2.2 hole 1.4: 2(0,0) 3(5.45,0)
TO-3PN_L15.8-W5.0-P5.45-L
  rect 3x3 hole 1.8: 1(-5.451,0)
  round 3 hole 1.8: 2(0,0) 3(5.451,0)
VR plastic
  round 2.032 hole 1: 1(-2.54,-5.08) 2(0,0) 3(2.54,-5.08)

## Nets
As in the schematic.

Pads without a net: NOREF 32; NOREF#2 31; NOREF#3 29; NOREF#4 30; U2 3; U4 5; U9 3; U10 5; U14 6 7; U15 6 7; U17 11 12 13 18 21 23 27 28

## Via types
v1: diameter 1.524, hole 0.8, Top Layer to Bottom Layer, 16 vias
v2: diameter 1.27, hole 0.8, Top Layer to Bottom Layer, 2 vias

## Routing (per net, layer and track width the routed paths; a pad name or vN(x,y) marks a point on that pad's centre or on a via; arc(x,y) is an arc through that point)
+5V: length 431.3
  Top Layer w1.016: v1(119.38,90.17) 119.42,90.21 v1(119.42,101.6) ; v1(59.69,120.65) v1(77.47,120.65)
  Bottom Layer w1.016: 149.86,42.54 U17.7 149.86,36.83 C8.2 ; 149.86,42.54 149.86,43.37 151.57,45.09 153.67,45.09 154.94,46.35 U17.20 154.94,50.8 ; 149.86,42.54 149.22,43.18 129.54,43.18 127,40.64 R32.1 C10.1 ; R21.2 152.94,118.11 D9.1 151.13,123.92 U10.1 149.22,128.27 141.6,135.89 132.72,135.89 125.09,128.27 R16.2 121.92,113.67 128.27,107.31 128.27,101.6 v1(119.42,101.6) 77.47,101.6 v1(77.47,120.65) ; R4.2 27.94,127 36.83,135.89 45.55,135.89 51.39,130.05 52.83,130.05 U4.1 54.61,121.92 ; D2.1 54.61,121.92 ; 54.61,121.92 R9.2 59.69,119.38 v1(59.69,120.65) ; 154.94,50.8 154.94,62.23 R25.2 152.4,67.31 R26.2 151.13,71.12 R27.2 149.86,88.27 147.96,90.17 v1(119.38,90.17) ; 154.94,50.8 C9.2 ; C10.1 108.17,32.23 ; C10.1 131.7,32.23 137.16,26.77 137.16,25.34 U18.2 137.28,21.4 152.32,6.35 R31.1 R30.1 R29.1 ; 108.17,32.23 C11.2 ; 108.17,32.23 106.2,32.23 102.76,35.67 U14.3
+12V: length 146.6
  Bottom Layer w0.254: U15.3 100.74,66.88
  Bottom Layer w1.016: 100.74,66.88 C12.2
  Bottom Layer w1.524: CN6.1 19.64,15.28 26.03,8.89 69.85,8.89 77.47,16.51 77.47,56.51 88.38,67.42 U15.3
+30V: length 216.5
  Bottom Layer w2.54: D12.2 163.19,101.6 154.94,93.34 67.94,93.34 ; D19.1 D22.1 34.77,59.69 C4.1 35.72,60.32 43.18,60.32 47.62,64.77 47.62,76.2 64.77,93.34 67.94,93.34 ; 67.94,93.34 68.58,93.98 D5.2
+130V: length 267.3
  Bottom Layer w1.524: D18.1 D15.1
  Bottom Layer w2.54: D13.1 D10.1 131.18,146.05 U8.3 117.21,154.94 55.34,154.94 D6.1 D3.1 41.91,146.05 39.37,143.51 U1.3 31.75,143.88 31.75,149.22 29.21,151.76 10.8,151.76 4.45,145.41 4.45,104.78 16.51,92.71 34.29,92.71 38.1,88.9 C3.1 32.39,80.64 29.75,80.64
GND: length 1082.2
  Bottom Layer w0.254: D21.2 29.75,56.52 29.82,56.45
  Bottom Layer w1.016: 150.15,54.61 D28.2 D27.2 ; 150.15,54.61 150.15,50.85 ; 150.15,54.61 D29.2 ; 106.04,123.95 102,128 U7.1 92.71,130.81 ; 106.04,123.95 106.04,115.57 107.31,114.3 R14.1 116.84,114.3 R18.1 ; 106.04,123.95 111.63,129.54 Q3.1 ; U17.8 152.38,40.43 C8.1 152.38,32.41 155.45,29.34 155.45,25.17 156.46,24.15 C6.1 C7.1 165.1,21.61 ; 62.23,113.67 61.59,113.03 Q2.1 46.99,106.68 ; 100.74,22 105.05,26.31 C11.1 124.58,26.31 C10.2 131.22,28.73 134.74,25.22 134.74,19.57 150.5,3.81 164.47,3.81 177.16,16.51 177.16,37.47 175.26,39.37 171.45,39.37 165.1,33.02 165.1,21.61 ; 100.74,22 98.65,22 95.25,25.4 95.25,43.93 U15.4 ; 100.74,22 U14.4 ; C9.1 151.1,50.85 150.15,50.85 ; 185.42,128.16 185.57,128 U13.1 ; 143.51,106.68 Q4.1 ; 143.51,106.68 R20.1 148.59,99.06 ; 143.51,106.68 C2.2 ; 150.15,50.85 149.86,50.56 U17.22 149.86,46.35 149.22,45.72 104.44,45.72 U15.4 ; 165.1,21.61 U16.5 ; 46.99,106.68 46.99,105.41 R8.1 50.8,100.97 49.28,99.44 33.91,99.44 30.48,102.87 R6.1 30.48,107.31 23.5,114.3 R2.1 9.52,114.3 8.89,114.94 8.89,126.37 12.06,129.54 Q1.1 ; 46.99,106.68 C1.2 ; U15.4 107.95,56.63 C12.1 107.97,57.15 110.49,57.15 111.12,57.78 111.12,64.14 104.78,70.48 87,70.48 74.3,57.78 74.3,22.86 69.11,17.67 U14.2
  Bottom Layer w1.524: D24.2 27.31,45.09 25.4,43.18 25.4,33.66 27.31,31.75 D25.2 ; D24.2 52.41,45.09 U15.2 ; D24.2 29.75,45.16 D21.2 ; 35.56,35.56 38.85,35.56 U14.2 ; 35.56,35.56 31.75,31.75 D25.2 ; 35.56,35.56 C5.2 ; D25.2 29.75,24.67 25.36,20.28 CN6.2
  Bottom Layer w2.54: 177.16,128.91 160.02,128.91 158.75,127.63 158.75,102.87 154.31,98.42 74.3,98.42 73.91,98.81 73.91,128.52 ; 177.16,128.91 177.16,132.18 D11.2 D14.2 ; 177.16,128.91 179.07,127 185.42,127 185.42,132.08 189.87,136.53 ; D7.2 D4.2 79.28,131.44 79.28,129.54 ; D20.2 34.29,67.31 35.56,66.04 C4.2 ; D20.2 26.67,67.31 25.4,66.04 25.4,57.78 26.67,56.51 26.94,56.51 27.58,55.88 D21.2 ; D20.2 D17.2 ; 79.28,129.54 74.93,129.54 73.91,128.52 ; 79.28,129.54 81.2,127.62 88.25,127.62 91.44,130.81 92.71,130.81 92.71,135.89 R11.1 95.62,138.8 U6.3 ; 73.91,128.52 73.66,128.27 63.5,128.27 62.86,127.63 62.86,100.97 C3.2 36.83,74.93 D17.2 ; R23.1 192.14,138.8 U12.3 ; D17.2 27.31,74.93 25.4,76.83 25.4,83.82 27.94,86.36 D16.2
BHV: length 110.9
  Top Layer w1.016: v1(146.69,87) v1(155.57,87) ; v1(109.22,104.78) v1(109.22,89.53)
  Bottom Layer w1.016: U17.16 165.1,52.71 160.66,57.15 160.66,70.48 155.57,75.56 v1(155.57,87) ; R13.1 v1(109.22,104.78) ; v1(109.22,89.53) 111.76,87 v1(146.69,87)
BLV: length 93.7
  Bottom Layer w1.016: R22.1 R24.2 181.61,113.03 158.12,89.53 153.67,89.53 152.4,88.27 152.4,74.93 157.48,69.85 157.48,55.88 162.56,50.8 U17.17
CBPS: length 52.4
  Bottom Layer w1.016: U17.24 144.78,59.4 D27.1 144.49,64.48 R25.1 146.69,66.67 146.69,74.93 144.78,76.83 127.63,76.83 126.37,75.56 126.37,72.47 CN7.1
CHV: length 216.2
  Top Layer w1.016: v1(146.69,80.01) v1(161.29,80.01) ; v1(50.8,95.25) 61.59,84.45 v1(62.23,84.45)
  Bottom Layer w1.016: v1(161.29,80.01) 161.29,77.47 167,71.75 167,59.06 169.54,56.51 169.54,52.07 175.9,45.72 175.9,43.18 173.99,41.28 168.47,41.28 U17.14 ; v1(146.69,80.01) 66.67,80.01 v1(62.23,84.45) ; v1(50.8,95.25) 49.53,96.52 28.58,96.52 26.67,98.42 26.67,100.97 19.05,108.58 13.34,108.58 R1.1
CLV: length 148.4
  Top Layer w1.016: v1(146.69,83.82) v1(158.12,83.82) ; v1(85.09,104.78) v1(85.09,89.53)
  Bottom Layer w1.016: v1(158.12,83.82) 158.12,76.83 164.47,70.48 164.47,57.78 167.02,55.23 167.02,49.07 U17.15 ; v1(85.09,89.53) 90.81,83.82 v1(146.69,83.82) ; R12.2 v1(85.09,104.78)
  Bottom Layer w1.27: R10.1 R12.2
FI: length 17.7
  Bottom Layer w1.016: U17.19 157.48,47.1 160.13,44.45 R28.1
IMS: length 31
  Bottom Layer w1.016: CN7.3 R27.1 142.24,70.48 139.41,67.66 D29.1 139.7,54.32 U17.26
PPS: length 41.9
  Bottom Layer w1.016: CN7.2 131.44,73.66 132.46,74.68 143.76,74.68 144.78,73.66 144.78,69.85 R26.1 141.95,67.02 D28.1 142.24,56.86 U17.25
SW1: length 33.6
  Bottom Layer w1.016: U17.4 142.24,36.19 146.69,31.75 146.69,30.31 149.35,27.65 149.35,21.93 153.5,17.78 U16.1 154.94,16.51 R31.2
SW2: length 33.4
  Bottom Layer w1.016: U17.5 144.78,36.19 148.72,32.26 148.72,30.82 151.13,28.41 151.13,23.5 154.31,20.32 156.21,20.32 157.48,19.05 U16.2 157.48,15.24 R30.2
SW3: length 33.3
  Bottom Layer w1.016: R29.2 U16.3 160.02,20.32 158.22,22.12 155.59,22.12 153.03,24.67 153.03,29.04 150.5,31.58 150.5,33.02 147.32,36.19 U17.6
$1N881: length 9.2
  Bottom Layer w1.016: R1.2 15.24,121.92 R2.2 Q1.3
$1N885: length 5.1
  Bottom Layer w1.016: Q1.2 R3.1
$1N1469: length 12.9
  Bottom Layer w2.032: R4.1 R3.2 21.22,134.99 U1.1
$1N1482: length 6.4
  Bottom Layer w1.016: 30.48,119.38 R6.2 ; 30.48,119.38 R5.1 ; 30.48,119.38 R7.1
$1N1581: length 18.1
  Bottom Layer w2.54: 30.48,138.97 26.67,142.78 U1.2 ; 30.48,138.97 R5.2 ; 30.48,138.97 D1.2
$1N2265: length 8.9
  Bottom Layer w1.016: R7.2 U2.1
$1N2438: length 17.8
  Bottom Layer w1.016: 44.45,118.09 44.47,118.11 U5.1 ; 44.45,118.09 44.45,121.38 D2.2 42.45,123.38 42.45,127.73 U4.2 ; 44.45,118.09 Q2.2
$1N2445: length 2.8
  Bottom Layer w1.016: U5.2 R9.1
$1N2514: length 20.9
  Bottom Layer w1.016: R8.2 43.18,106.41 C1.1 41.91,108.22 Q2.3 39.37,113.03 36.83,110.49 U2.2
$1N3198: length 14.3
  Bottom Layer w2.54: D1.1 38.64,132.08 42.77,132.08 47.85,127 U4.3
$1N3543: length 47.4
  Bottom Layer w2.032: 61.27,137.16 61.27,137.43 64.14,140.3
  Bottom Layer w2.54: 64.14,140.3 CN1.1 59.73,146.05 D3.2 ; 72.77,133.63 72.48,133.35 65.39,133.35 61.59,137.15 61.55,137.11 61.5,137.16 52.7,137.16 48.89,140.97 U4.4
$1N3736: length 13.9
  Bottom Layer w2.032: R10.2 86.36,132.08 R11.2 84.72,138.8 U6.1
$1N3816: length 51.1
  Bottom Layer w2.032: 73.12,136.92 D7.1 73.12,137.66 CN1.2
  Bottom Layer w2.54: 69.81,148.59 69.81,148.84 68.79,149.86 D6.2 ; 69.81,148.59 CN1.2 ; 69.81,148.59 71.08,149.86 88.9,149.86 90.17,148.59 U6.2
$1N3949: length 5.3
  Bottom Layer w1.016: R12.1 U7.2
$1N7232: length 7.9
  Bottom Layer w1.016: R13.2 R14.2 Q3.3
$1N7233: length 5.6
  Bottom Layer w1.016: Q3.2 116.84,127 R15.1
$1N7238: length 11.6
  Bottom Layer w2.032: R16.1 R15.2 117.74,136.26 U8.1
$1N7240: length 18.9
  Bottom Layer w1.016: D8.2 127.73,134.62 R17.2
  Bottom Layer w2.54: D8.2 127.73,138.97 U8.2
$1N7241: length 9.5
  Bottom Layer w1.016: R17.1 125.73,119.38 ; 125.73,119.38 R18.2 ; 125.73,119.38 R19.1
$1N7242: length 9.2
  Bottom Layer w1.016: U9.1 130.81,111.12 R19.2
$1N7256: length 18.5
  Bottom Layer w1.016: U10.2 138.43,123.92 D9.2 140.97,121.38 140.97,118.03 ; Q4.2 140.97,118.03 ; 140.97,118.03 141.05,118.11 U11.1
$1N7257: length 2.2
  Bottom Layer w1.016: R21.1 U11.2
$1N7258: length 17.7
  Bottom Layer w1.016: 138.43,108.22 138.16,107.95 U9.2 ; 138.43,108.22 Q4.3 ; 138.43,108.22 C2.1 139.97,102.6 R20.2
$1N7259: length 15.6
  Bottom Layer w2.54: U10.3 139.7,132.08 133.89,132.08 D8.1
$1N7271: length 47.8
  Bottom Layer w2.54: 164.47,133.99 165.74,132.72 D11.1 ; U10.4 144.15,140.97 150.5,134.62 160.56,134.62 161.29,133.89 ; D10.2 156.75,145.55 CN2.1 161.29,140.93 161.29,133.89 ; 164.12,133.99 161.38,133.99 161.29,133.89
$1N7288: length 14.1
  Bottom Layer w2.032: R22.2 181.61,137.16 ; 181.61,137.16 R23.2 ; 181.61,137.16 181.61,143.14 U12.1
$1N7292: length 48.4
  Bottom Layer w2.54: 166.33,146.4 162.87,149.86 D13.2 ; 166.33,146.4 CN2.2 168.37,138.93 168.37,137.16 D14.1 ; 166.33,146.4 166.33,146.65 169.54,149.86 183.51,149.86 186.69,146.69 U12.2
$1N7302: length 5.3
  Bottom Layer w1.016: U13.2 R24.1
$1N8581: length 9.6
  Bottom Layer w2.54: CN3.2 15.28,82.55 D15.2 D16.1
$1N8589: length 10.1
  Bottom Layer w2.54: D17.1 D18.2 16.47,78.74 CN3.1
$1N8975: length 9.6
  Bottom Layer w2.54: 21.05,65.33 D20.1 ; 21.05,65.33 D19.2 ; 21.05,65.33 CN4.2
$1N8978: length 9.8
  Bottom Layer w2.54: D21.1 D22.2 15.92,59.69 CN4.1
$1N9405: length 10.3
  Bottom Layer w1.524: D23.2 21.05,43.14 ; 21.05,43.14 CN5.2 ; 21.05,43.14 21.12,43.21 D24.1
$1N9408: length 11.2
  Bottom Layer w1.524: CN5.1 17.18,36.2 D26.2 21.12,31.82 D25.1
$1N9556: length 69.7
  Bottom Layer w1.524: D26.1 29.82,40.57 D23.1 30.23,41.12 C5.1 51.29,41.12 U14.1 61.59,40.53 61.59,62.56 U15.1
$1N10766: length 32.2
  Bottom Layer w1.016: U16.4 162.56,15.88 163.83,14.6 168.28,14.6 172.72,19.05 R28.2
$1N11606: length 16.8
  Bottom Layer w0.254: 162.46,35.56 R33.2
  Bottom Layer w1.016: C7.2 162.56,30.38 X1.1 162.46,35.56 161.02,35.56 157.48,39.1 U17.10
$1N11615: length 15
  Bottom Layer w0.254: X1.2 157.48,30.48
  Bottom Layer w1.016: C6.2 157.48,30.48 154.94,33.02 R33.1 U17.9
$1N11970: length 5
  Bottom Layer w1.016: 144.76,20.32 144.9,20.46 U18.5
$1N11973: length 33.8
  Top Layer w1.016: v2(137.79,29.21) v2(144.78,29.21)
  Bottom Layer w1.016: v2(137.79,29.21) 137.79,31.12 134.62,34.29 R32.2 U17.1 ; C13.1 146.07,17.8 147.32,19.05 147.32,26.67 v2(144.78,29.21)
$1N11982: length 16.3
  Bottom Layer w1.016: U17.3 139.7,35.56 142.24,33.02 142.24,25.34 U18.4
$1N11987: length 16.3
  Bottom Layer w1.016: U18.3 139.7,25.34 139.7,32.38 137.16,34.93 U17.2

## Text on the board
Bottom Layer: Clutch Break Controller V1.0 | HDPS
